# EAGLE design Luminet2_2_0 (EAGLE 5.11)
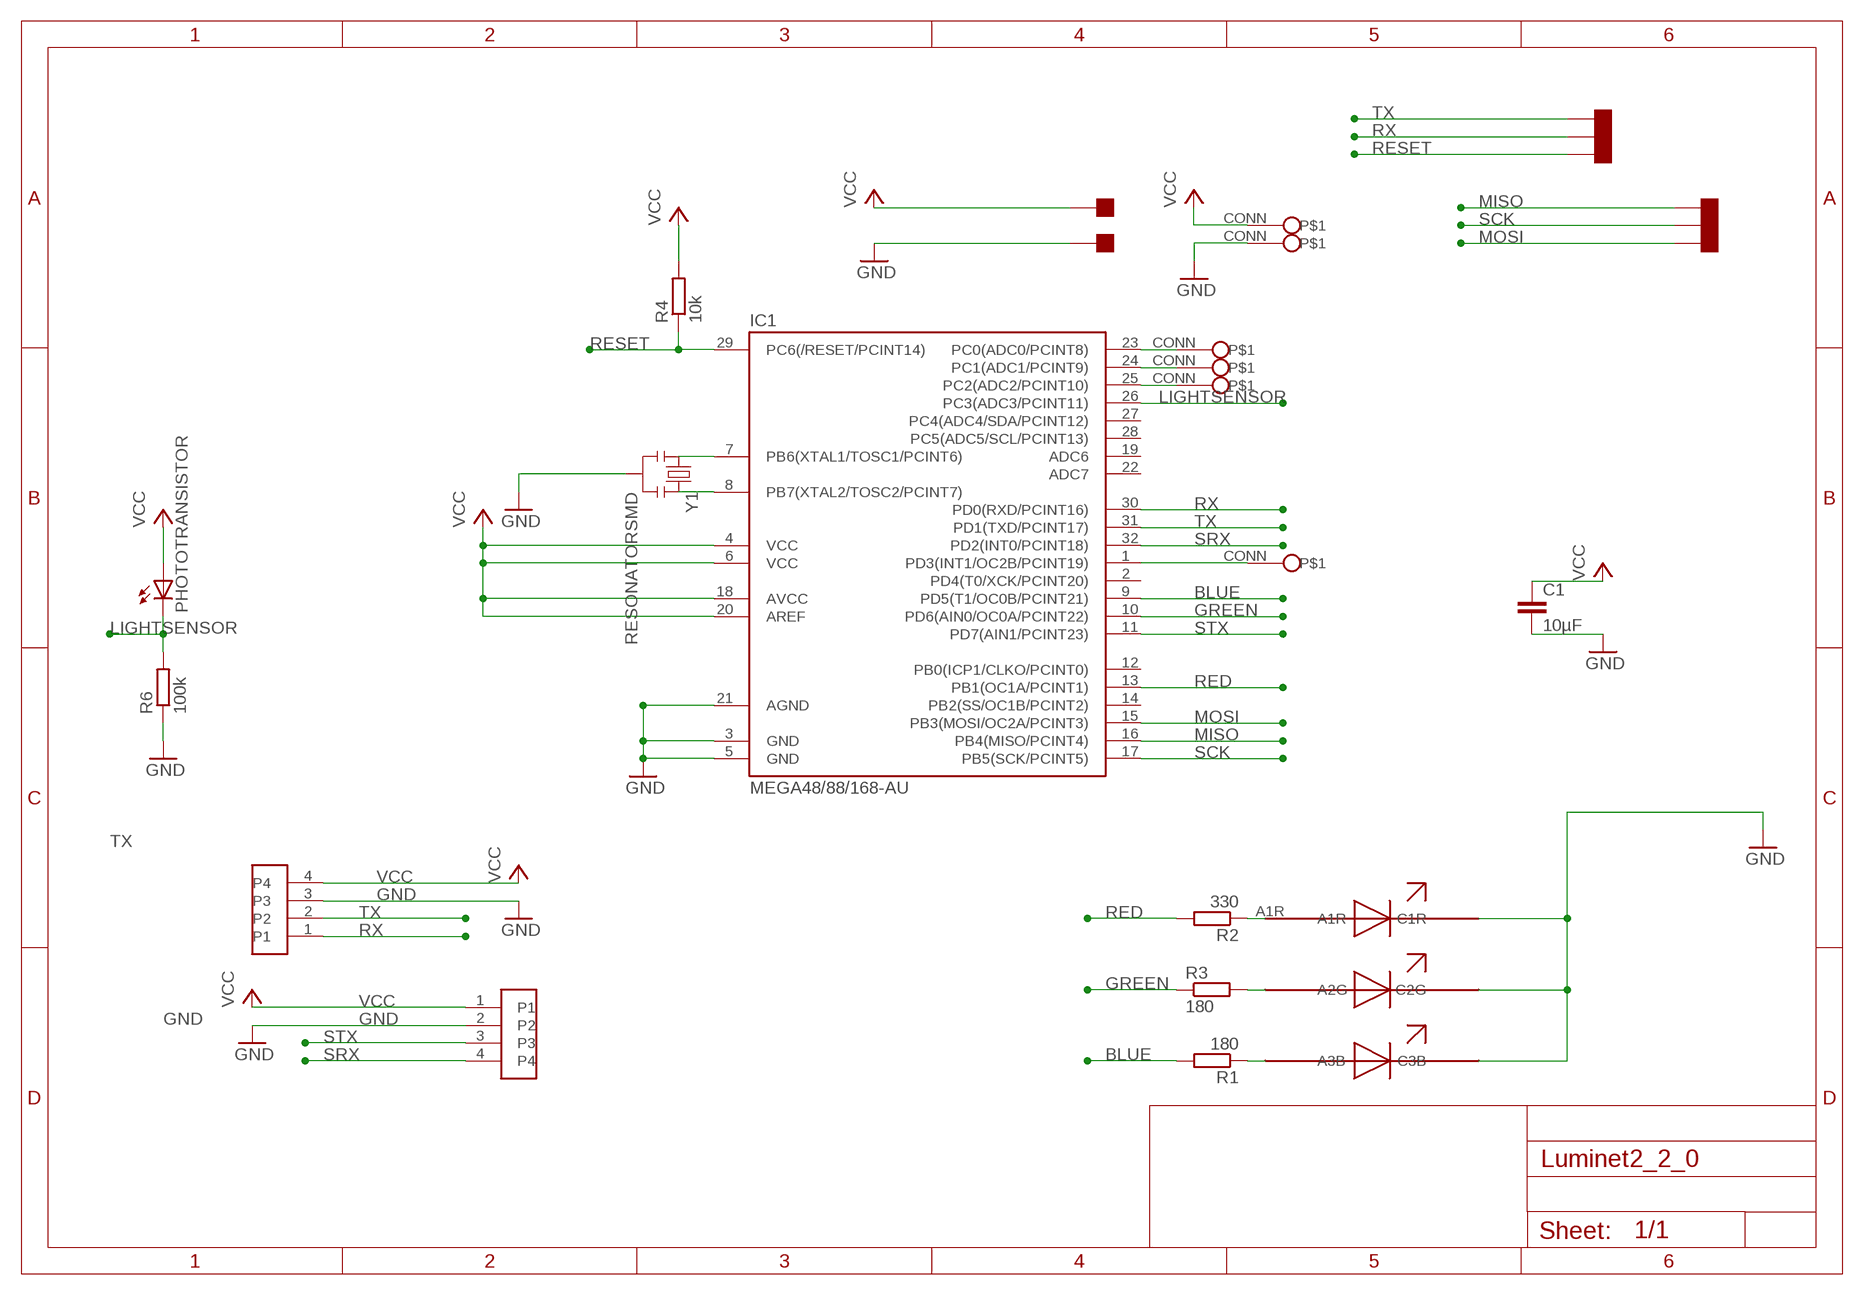
[diagram p0: schematic, sheet 1]

## Parts
C1  10µF  C-EUC0603  [C0603]
GND  SEWCONN  [SEWCONN]
IC1  MEGA48/88/168-AU  [TQFP32-08]
PHOTOTRANSISTOR  LEDCHIPLED_0805  [CHIPLED_0805]
R1  180  R-EU_R0603  [R0603]
R2  330  R-EU_R0603  [R0603]
R3  180  R-EU_R0603  [R0603]
R4  10k  R-EU_R0603  [R0603]
R6  100k  R-EU_R0603  [R0603]
U$1  FEDERPADSMALL  [FEDERPADSMALL]
U$2  FEDERPADSMALL  [FEDERPADSMALL]
U$4  SEWCONN  [SEWCONN]
U$5  SEWCONN  [SEWCONN]
U$6  FEDERPADSMALL  [FEDERPADSMALL]
U$9  SEWCONN  [SEWCONN]
U$10  COMMCON  [COMCONN]
U$11  COMMCON  [COMCONN]
U$12  FEDERPADSMALL  [FEDERPADSMALL]
U$13  SEWCONN  [SEWCONN]
U$14  LED-RGB-SMD  [OVSTRGBBCR8]
U$15  FEDERPADSMALL  [FEDERPADSMALL]
U$16  FEDERPADSMALL  [FEDERPADSMALL]
U$17  FEDERPADSMALL  [FEDERPADSMALL]
U$18  FEDERPADSMALL  [FEDERPADSMALL]
VCC  SEWCONN  [SEWCONN]
Y1  RESONATORSMD  [RESONATOR-SMD]

## Nets
BLUE: IC1.9(PD5(T1/OC0B/PCINT21)) R1.2
GND: C1.2 GND.CONN IC1.3(GND) IC1.5(GND) IC1.21(AGND) R6.1 U$2.P$1 U$10.3 U$11.2 U$14.C1R U$14.C2G U$14.C3B Y1.2
GREEN: IC1.10(PD6(AIN0/OC0A/PCINT22)) R3.1
LIGHTSENSOR: IC1.26(PC3(ADC3/PCINT11)) PHOTOTRANSISTOR.C R6.2
MISO: IC1.16(PB4(MISO/PCINT4)) U$16.P$1
MOSI: IC1.15(PB3(MOSI/OC2A/PCINT3)) U$18.P$1
N$1: IC1.7(PB6(XTAL1/TOSC1/PCINT6)) Y1.1
N$2: IC1.8(PB7(XTAL2/TOSC2/PCINT7)) Y1.3
N$3: IC1.1(PD3(INT1/OC2B/PCINT19)) U$13.CONN
N$4: IC1.23(PC0(ADC0/PCINT8)) U$4.CONN
N$5: IC1.24(PC1(ADC1/PCINT9)) U$5.CONN
N$6: R1.1 U$14.A3B
N$7: R3.2 U$14.A2G
N$8: IC1.25(PC2(ADC2/PCINT10)) U$9.CONN
N$9: R2.1 U$14.A1R
RED: IC1.13(PB1(OC1A/PCINT1)) R2.2
RESET: IC1.29(PC6(/RESET/PCINT14)) R4.1 U$15.P$1
RX: IC1.30(PD0(RXD/PCINT16)) U$10.1 U$12.P$1
SCK: IC1.17(PB5(SCK/PCINT5)) U$17.P$1
SRX: IC1.32(PD2(INT0/PCINT18)) U$11.4
STX: IC1.11(PD7(AIN1/PCINT23)) U$11.3
TX: IC1.31(PD1(TXD/PCINT17)) U$6.P$1 U$10.2
VCC: C1.1 IC1.4(VCC) IC1.6(VCC) IC1.18(AVCC) IC1.20(AREF) PHOTOTRANSISTOR.A R4.2 U$1.P$1 U$10.4 U$11.1 VCC.CONN
Unconnected: IC1.2(PD4(T0/XCK/PCINT20)) IC1.12(PB0(ICP1/CLKO/PCINT0)) IC1.14(PB2(SS/OC1B/PCINT2)) IC1.19(ADC6) IC1.22(ADC7) IC1.27(PC4(ADC4/SDA/PCINT12)) IC1.28(PC5(ADC5/SCL/PCINT13))

## Library data of the parts
C1 = rcl:C-EU: CAPACITOR, European symbol
GND U$4 U$5 U$9 U$13 VCC = Luminet1:SEWCONN
IC1 = avr-7:MEGA48/88/168
PHOTOTRANSISTOR = led:LED: LED OSRAM: - CHIPLED LG R971, LG N971, LY N971, LG Q971, LY Q971, LO R971, LY R971 LH N974, LH R974 LS Q976, LO Q976, LY Q976 LO Q996 - Hyper CHIPLED LW Q18S LB Q993, LB Q99A, LB R99A - SideLED LS A670, LO A670, LY A670, LG A670, LP A670 LB A673, LV A673, LT A673, LW A673 LH A674 LY A675 LS A676, LA A676, LO A676, LY A676, LW A676 LS A679, LY A679, LG A679 - Hyper Micro SIDELED® LS Y876, LA Y876, LO Y876, LY Y876 LT Y87S - SmartLED LW L88C, LW L88S LB L89C, LB L89S, LG L890 LS L89K, LO L89K, LY L89K LS L896, LA L896, LO L896, LY L896 - TOPLED LS T670, LO T670, LY T670, LG T670, LP T670 LSG T670, LSP T670, LSY T670, LOP T670, LYG T670 LG T671, LOG T671, LSG T671 LB T673, LV T673, LT T673, LW T673 LH T674 LS T676, LA T676, LO T676, LY T676, LB T676, LH T676, LSB T676, LW T676 LB T67C, LV T67C, LT T67C, LS T67K, LO T67K, LY T67K, LW E67C LS E67B, LA E67B, LO E67B, LY E67B, LB E67C, LV E67C, LT E67C LW T67C LS T679, LY T679, LG T679 LS T770, LO T770, LY T770, LG T770, LP T770 LB T773, LV T773, LT T773, LW T773 LH T774 LS E675, LA E675, LY E675, LS T675 LS T776, LA T776, LO T776, LY T776, LB T776 LHGB T686 LT T68C, LB T68C - Hyper Mini TOPLED® LB M676 - Mini TOPLED Santana® LG M470 LS M47K, LO M47K, LY M47K Source: http://www.osram.convergy.de LUXEON: - LUMILED® LXK2-PW12-R00, LXK2-PW12-S00, LXK2-PW14-U00, LXK2-PW14-V00 LXK2-PM12-R00, LXK2-PM12-S00, LXK2-PM14-U00 LXK2-PE12-Q00, LXK2-PE12-R00, LXK2-PE12-S00, LXK2-PE14-T00, LXK2-PE14-U00 LXK2-PB12-K00, LXK2-PB12-L00, LXK2-PB12-M00, LXK2-PB14-N00, LXK2-PB14-P00, LXK2-PB14-Q00 LXK2-PR12-L00, LXK2-PR12-M00, LXK2-PR14-Q00, LXK2-PR14-R00 LXK2-PD12-Q00, LXK2-PD12-R00, LXK2-PD12-S00 LXK2-PH12-R00, LXK2-PH12-S00 LXK2-PL12-P00, LXK2-PL12-Q00, LXK2-PL12-R00 Source: www.luxeon.com KINGBRIGHT: KA-3528ASYC Source: www.kingbright.com
R1-R4 R6 = rcl:R-EU_: RESISTOR, European symbol
U$1 U$2 U$6 U$12 U$15-U$18 = Luminet1:FEDERPAD
U$10 U$11 = Luminet1:COMMCON
U$14 = led-rgb-smd:LED-RGB-SMD: OSRAM RGB LED SMD LRTB G6TG 6-lead MULTILED. P-LCC-6 package. DigiKey part no. 475-1319-1-ND. Created by Jan Borchers on 2008-06-02.
Y1 = SparkFun:RESONATOR: Resonator Small SMD resonator. This is the itty bitty 10/20MHz resonators with built in caps. CSTCE10M0G55 and CSTCE20M0V53. Footprint has been reviewed closely but hasn't been tested yet.

## Board
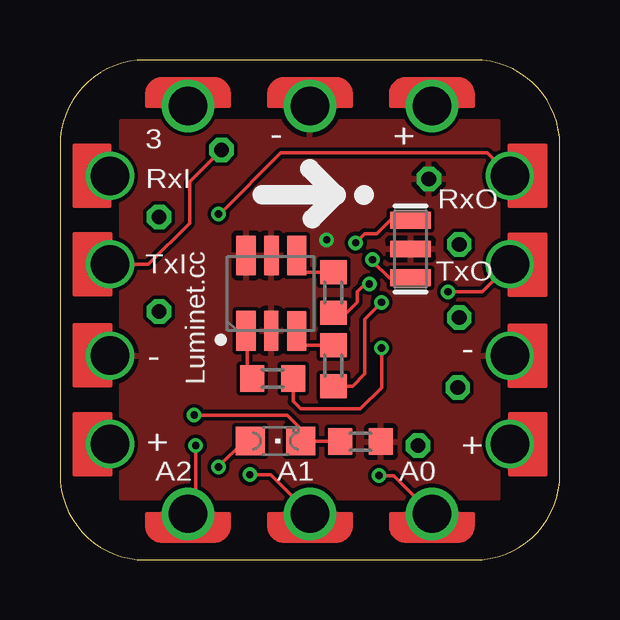
[diagram p1: board, top side]
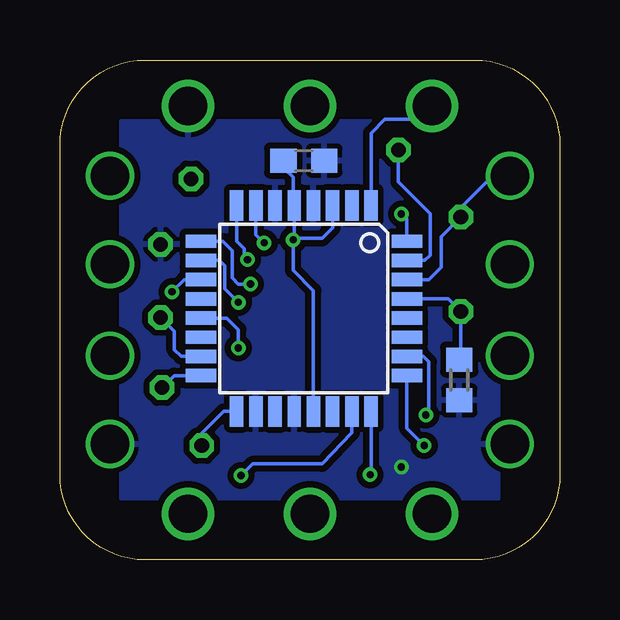
[diagram p2: board, bottom side, seen from below]

Size 20.83 x 20.83 mm. Coordinates in mm from the lower left corner, seen from the top.
Outline: 17.27,0 arc90 20.83,3.56 20.83,17.27 arc90 17.27,20.83 3.56,20.83 arc90 0,17.27 0,3.56 arc90 3.56,0 17.27,0
Copper layers (1*16): Top 0.035mm / dielectric 1.5mm / Bottom 0.035mm
Design rules "leiton": minimum track width 6mil, minimum drill 0.3mm, track to track 6mil, track to pad 6mil, pad to pad 6mil, via to via 6mil, smd to smd 6mil, copper to edge 20mil, drill to drill 8mil, minimum pad ring 8mil, minimum via ring 6mil, stop-mask expansion 3mil, vias tented up to drill 0mil, thermal gap 8mil

### Footprints (pad centres in the part's own frame; a part is rotated, then mirrored left to right if it is on the bottom)
C0603 = smd 1.1 x 1: 1 -0.85,0; 2 0.85,0
SEWCONN = drill 1.6 pad 2.184 round: CONN 0,0
TQFP32-08 = smd 1.27 x 0.559: 1 -4.293,2.8; 2 -4.293,2; 3 -4.293,1.2; 4 -4.293,0.4; 5 -4.293,-0.4; 6 -4.293,-1.2; 7 -4.293,-2; 8 -4.293,-2.8; 17 4.293,-2.8; 18 4.293,-2; 19 4.293,-1.2; 20 4.293,-0.4; 21 4.293,0.4; 22 4.293,1.2; 23 4.293,2; 24 4.293,2.8 | smd 0.559 x 1.27: 9 -2.8,-4.293; 10 -2,-4.293; 11 -1.2,-4.293; 12 -0.4,-4.293; 13 0.4,-4.293; 14 1.2,-4.293; 15 2,-4.293; 16 2.8,-4.293; 25 2.8,4.293; 26 2,4.293; 27 1.2,4.293; 28 0.4,4.293; 29 -0.4,4.293; 30 -1.2,4.293; 31 -2,4.293; 32 -2.8,4.293
CHIPLED_0805 = smd 1.2 x 1.2: A 0,-1.05; C 0,1.05
R0603 = smd 1 x 1.1: 1 -0.85,0; 2 0.85,0
FEDERPADSMALL = drill 0.61 octagon: P$1 0,0
COMCONN = drill 1.6 round: 1 0,-5.588; 2 0,-1.905; 3 0,1.905; 4 0,5.588
OVSTRGBBCR8 = smd 0.8 x 1.65: A1R 1.226,1.402; A2G -0.884,1.408; A3B -0.881,-1.737; C1R 1.226,-1.742 | smd 0.6 x 1.65: C2G 0.178,1.4; C3B 0.172,-1.74
RESONATOR-SMD = smd 0.7 x 1.7: 1 -1.2,0; 2 0,0; 3 1.2,0

### Placement (x,y rotation side)
C1  10.67,16.64 180 bottom
GND  10.41,18.91 0 top
IC1  10.67,10.48 270 bottom
PHOTOTRANSISTOR  8.98,4.95 270 top
R1  11.39,11.14 270 top
R2  8.86,7.56 0 top
R3  11.39,8.09 90 top
R4  4.19,7.49 270 bottom
R6  12.52,4.93 180 top
U$1  16.64,13.14 180 top
U$2  15.37,15.88 180 top
U$4  15.49,1.92 180 top
U$5  10.41,1.92 180 top
U$6  6.73,17.08 180 top
U$9  5.33,1.92 180 top
U$10  2.08,10.41 180 top
U$11  18.75,10.41 0 top
U$12  4.13,14.29 180 top
U$13  5.33,18.91 0 top
U$14  8.98,10.95 180 top
U$15  4.13,10.35 180 top
U$16  16.57,7.18 180 top
U$17  14.92,4.76 180 top
U$18  16.64,10.1 180 top
VCC  15.49,18.91 0 top
Y1  14.61,12.95 270 top

### Tracks (layer width: path | path; a pad name or v marks a point on that pad's centre or on a via)
BLUE  (via drill 0.3)
  Top 0.152: v12.89,11.49 12.7,11.49 12.38,11.18 12.38,10.73 11.94,10.29 R1.2
  Bottom 0.152: IC1.9 14.04,13.28 13.65,12.89 13.65,11.75 13.4,11.49 v12.89,11.49
GND  (via drill 0.3)
  Top 0.152: U$14.C3B
  Bottom 0.152: C1.2 11.45,16.28 11.11,15.94 11.11,14.81 IC1.5 11.07,13.38 v11.11,13.34 | IC1.3 9.47,13.84 9.91,13.4 11.05,13.4 v11.11,13.34 | IC1.21 10.27,11.22 11.11,12.06 v11.11,13.34
  pour Top: 2.54,2.54 2.54,18.29 18.29,18.29 18.29,2.54
GREEN  (via drill 0.3)
  Top 0.152: v13.4,10.73 12.7,10.03 12.7,7.75 12.19,7.24 R3.1
  Bottom 0.152: IC1.10 14.19,12.48 13.97,12.26 13.97,11.3 v13.4,10.73
LIGHTSENSOR  (via drill 0.3)
  Top 0.152: v5.59,6.03 9.46,6.03 10.03,5.46 PHOTOTRANSISTOR.C 11.65,4.95 R6.2
  Bottom 0.152: IC1.26 5.68,8.48 5.46,8.26 5.46,6.16 v5.59,6.03
MISO
  Bottom 0.152: IC1.16 16.07,7.68 U$16.P$1
MOSI
  Bottom 0.152: IC1.15 15.78,8.48 16.07,8.76 16.07,9.53 U$18.P$1
N$1  (via drill 0.3)
  Top 0.152: Y1.1 15.04,14.41 14.03,14.41 13.21,13.59 12.7,13.59 v12.32,13.21
  Bottom 0.152: IC1.7 12.67,13.56 v12.32,13.21
N$2  (via drill 0.3)
  Top 0.152: v13.02,12.51 13.02,12.45 13.72,11.75 14.6,11.75 Y1.3
  Bottom 0.152: IC1.8 13.47,13.28 13.14,12.95 13.14,12.64 v13.02,12.51
N$3
  Bottom 0.152: IC1.1 7.87,17.79 7.3,18.35 5.93,18.35 U$13.CONN
N$4  (via drill 0.3)
  Top 0.152: v13.29,3.51 13.9,3.51 U$4.CONN
  Bottom 0.152: IC1.23 8.67,5.3 9.91,4 12.8,4 v13.29,3.51
N$5  (via drill 0.3)
  Top 0.152: v7.91,3.55 8.78,3.55 U$5.CONN
  Bottom 0.152: IC1.24 7.87,3.59 v7.91,3.55
N$6
  Top 0.152: R1.1 10.11,11.99 9.91,12.19 9.91,12.64 U$14.A3B
N$7
  Top 0.152: 10.15,9.83 U$14.A2G 9.84,9.52 9.84,9.02 9.92,8.94 R3.2
N$8  (via drill 0.3)
  Top 0.152: v5.65,4.76 5.65,2.24 U$9.CONN
  Bottom 0.152: IC1.25 6.38,5.49 v5.65,4.76
N$9
  Top 0.152: R2.1 8.08,7.73 7.81,8 7.81,9.49 U$14.A1R
RED  (via drill 0.3)
  Top 0.152: 9.84,7.43 R2.2 9.72,6.6 10.03,6.29 12.51,6.29 13.4,7.18 v13.4,8.83
  Bottom 0.152: IC1.13 13.89,10.08 13.4,9.59 v13.4,8.83
RESET
  Bottom 0.152: IC1.29 4.65,10.88 U$15.P$1 4.13,8.41 R4.1
RX
  Bottom 0.152: IC1.30 5.47,11.68 4.95,12.19 4.95,13.46 U$12.P$1 4.13,14.67 2.79,16 U$10.1
SCK
  Bottom 0.152: IC1.17 14.01,6.18 14.99,5.21 14.99,4.83 U$17.P$1
SRX  (via drill 0.3)
  Top 0.152: v6.6,14.41 6.67,14.41 9.21,16.95 17.79,16.95 U$11.4
  Bottom 0.152: IC1.32 6.38,14.19 v6.6,14.41
STX  (via drill 0.3)
  Top 0.152: v16.16,11.17 17.59,11.17 U$11.3
  Bottom 0.152: IC1.11 15.65,11.68 v16.16,11.17
TX
  Top 0.152: U$10.2 3.68,12.32 5.4,14.03 5.4,15.75 U$6.P$1
  Bottom 0.152: IC1.31 5.62,12.48 5.4,12.7 5.4,14.41 6.73,15.75 U$6.P$1
VCC  (via drill 0.3)
  Top 0.152: PHOTOTRANSISTOR.A 7.68,4.95 v6.6,3.87
  pour Bottom (isolate 0.254): 2.54,2.54 18.29,2.54 18.29,18.29 2.54,18.29

### Text on the board
tPlace: 3 | - | + | RxI | RxO | TxI | TxO | - | - | Luminet.cc | + | + | A2 | A1 | A0